# Altium schematic sheet SENSOR.SchDoc
size A4; Author: Khanh BK; Organization: DB Bach Khoa HN; Address1: Bach Khoa- HBT - HN; Address2: khanh.db192932; Address3: Youtube: Đào Bá Khánh; Address4: 0357698570; Revision: 1.0Ver; SheetNumber: 6; SheetTotal: 6
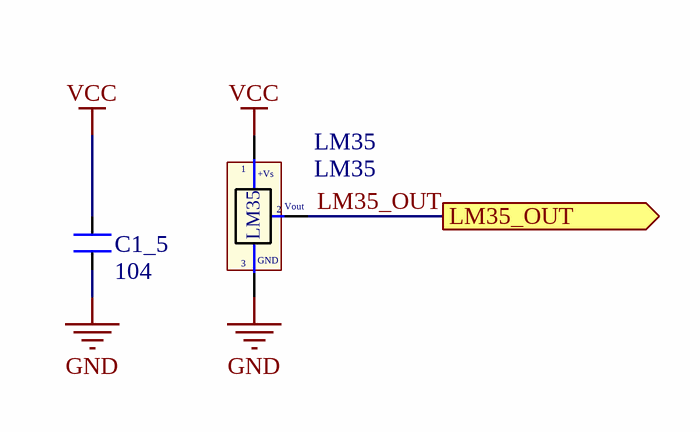
[diagram p0: SENSOR.SchDoc]

## Parts
C1_5  104  [CN-SMD-0805]
LM35  LM35  [TO92-123]

## Ports
LM35_OUT (out)

## Nets
GND: C1_5.1 LM35.3(-)
VCC: C1_5.2 LM35.1(+Vs)
LM35_OUT: LM35.2(Vout) ; port LM35_OUT

## Notes on the sheet
- Title
- Size:
- Date:
- Author:
- A4
- Time:
- Number:
- Checked:
- Revision:
- Sheet
- Approved:
- of
- File:
- (in symbol LM35) GND

## Library data of the parts
C1_5 = CN: Value: 33pF
LM35 = LM35: Teminal; Value: LM35